# Altium schematic sheet bluetoothle.SchDoc
size A4
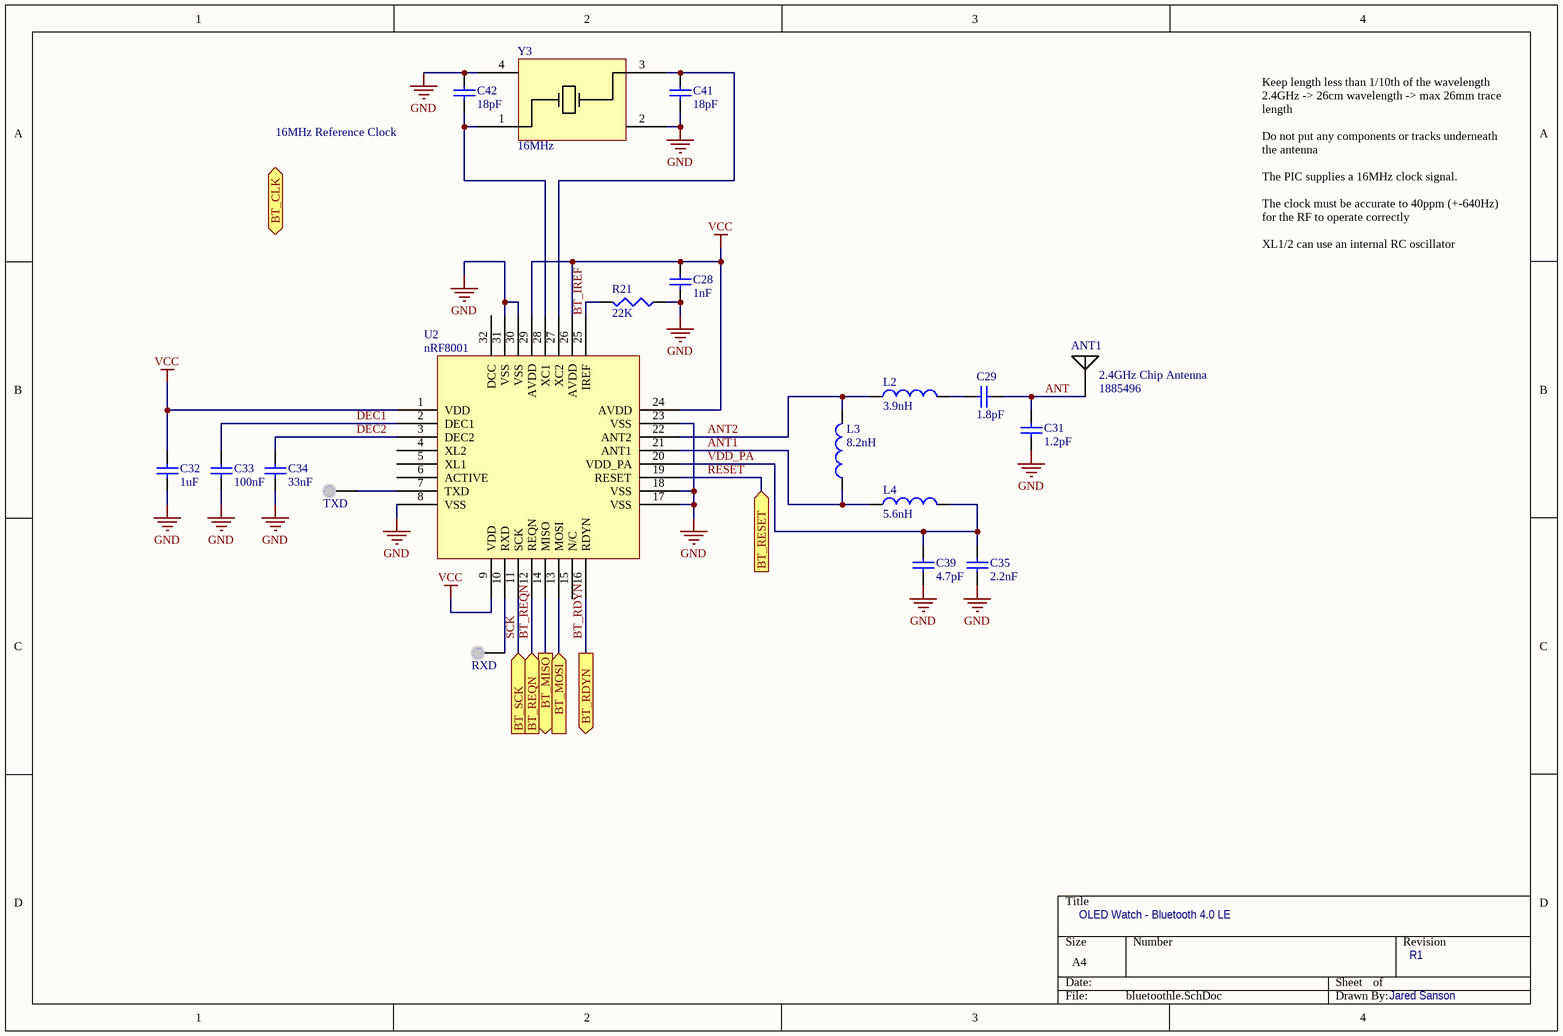
[diagram p0: bluetoothle.SchDoc]

## Parts
ANT1  2.4GHz Chip Antenna  Supplier Part Number 1: 1885496  [2450AT18A100E]
C28  value 1nF  [0603C]  (hidden comment: Cap)
C29  value 1.8pF  [0603C]  (hidden comment: Cap)
C31  value 1.2pF  [0603C]  (hidden comment: Cap)
C32  value 1uF  [0805C]  (hidden comment: Cap)
C33  value 100nF  [0603C]  (hidden comment: Cap)
C34  value 33nF  [0603C]  (hidden comment: Cap)
C35  value 2.2nF  [0603C]  (hidden comment: Cap)
C39  value 4.7pF  [0603C]  (hidden comment: Cap)
C41  value 18pF  [0603C]  (hidden comment: Cap)
C42  value 18pF  [0603C]  (hidden comment: Cap)
L2  value 3.9nH  [0603L]  (hidden comment: Inductor)
L3  value 8.2nH  [0603L]  (hidden comment: Inductor)
L4  value 5.6nH  [0603L]  (hidden comment: Inductor)
R21  value 22K  [0603R]  (hidden comment: Res3)
RXD  AN4  [TESTPOINT_TOP]  (value not drawn)
TXD  AN4  [TESTPOINT_TOP]  (value not drawn)
U2  nRF8001  [QFN50P500X500-32V5N]
Y3  value 16MHz  [TXC-16MHZ]  (hidden comment: TXC-16MHz)

## Ports
BT_CLK (in), BT_MISO (out), BT_MOSI (in), BT_RDYN (out), BT_REQN (in), BT_RESET (in), BT_SCK (in)

## Nets
GND: C28.1 C31.1 C32.2 C33.2 C34.2 C35.2 C39.2 C41.1 C42.2 R21.1 U2.8(VSS) U2.17(VSS) U2.18(VSS) U2.23(VSS) U2.30(VSS) U2.31(VSS) Y3.2 Y3.4
VCC: C28.2 C32.1 U2.1(VDD) U2.9(VDD) U2.24(AVDD) U2.26(AVDD) U2.29(AVDD)
ANT: ANT1.1 C29.2 C31.2
ANT1: L3.1 L4.1 U2.21(ANT1)
ANT2: L2.1 L3.2 U2.22(ANT2)
BT_IREF: R21.2 U2.25(IREF)
BT_MISO: U2.14(MISO) ; port BT_MISO
BT_MOSI: U2.13(MOSI) ; port BT_MOSI
BT_RDYN: U2.16(RDYN) ; port BT_RDYN
BT_REQN: U2.12(REQN) ; port BT_REQN
DEC1: C33.1 U2.2(DEC1)
DEC2: C34.1 U2.3(DEC2)
RESET: U2.19(RESET) ; port BT_RESET
SCK: U2.11(SCK) ; port BT_SCK
VDD_PA: C35.1 C39.1 L4.2 U2.20(VDD_PA)
NetC29_1: C29.1 L2.2
NetC41_2: C41.2 U2.27(XC2) Y3.3
NetC42_1: C42.1 U2.28(XC1) Y3.1
NetRXD_1: RXD.1(TP) U2.10(RXD)
NetTXD_1: TXD.1(TP) U2.7(TXD)

Not connected (* = marked no-connect by the designer): U2 4(XL2) 5(XL1) 6(ACTIVE) 15(N/C) 32(DCC)

## Notes on the sheet
- 16MHz Reference Clock
- Keep length less than 1/10th of the wavelength
  2.4GHz -> 26cm wavelength -> max 26mm trace length
  Do not put any components or tracks underneath the antenna
  The PIC supplies a 16MHz clock signal.
  The clock must be accurate to 40ppm (+-640Hz) for the RF to operate correctly
  XL1/2 can use an internal RC oscillator
- OLED Watch - Bluetooth 4.0 LE
- R1
- Jared Sanson

## Library data of the parts
ANT1 = 2450AT18A100E: Manufacturer: JOHANSON TECHNOLOGY; Description: JOHANSON TECHNOLOGY - 2450AT18A100E - ANTENNA, CERAMIC, 2.45GHZ; Supplier 1: Farnell; Manufacturer Part Number: 2450AT18A100E; RoHS: Y-EX; Pricing 1: 1=1.63, 10=1.26, 100=1.03, 500=0.693, 3000=0.511 (NZD); ComponentLink1URL: http://www.farnell.com/datasheets/1318306.pdf; ComponentLink1Description: http://www.farnell.com/datasheets/1318306.pdf; ComponentLink2URL: http://www.farnell.com/datasheets/1318299.pdf; ComponentLink2Description: http://www.farnell.com/datasheets/1318299.pdf; ComponentLink3URL: http://www.johansontechnology.com/images/stories/ip/rf-antennas/Antenna_2450AT18A100.pdf; ComponentLink3Description: http://www.johansontechnology.com/images/stories/ip/rf-antennas/Antenna_2450AT18A100.pdf
C28 C29 C31-C35 C39 C41 C42 = Cap: Capacitor; Published: 8-Jun-2000; LatestRevisionDate: 17-Jul-2002; LatestRevisionNote: Re-released for DXP Platform.; PackageReference: RAD-0.3; Publisher: Altium Limited; PackageDescription: Radial Cap, Thru-Hole; 2 Leads; 0.3 in Pin Spacing
L2-L4 = Inductor: Code_IEC: 1005; Published: 8-Jun-2000; LatestRevisionDate: 29-May-2009; LatestRevisionNote: IPC-7351 Footprint Added.; PackageReference: 0402-A; Publisher: Altium Limited; PackageDescription: Chip Inductor; Code_JEITA: 0402
R21 = Res3: Resistor; Published: 8-Jun-2000; LatestRevisionDate: 29-May-2009; LatestRevisionNote: IPC-7351 Footprint Added.; PackageReference: J1-0603; Publisher: Altium Limited; PackageDescription: Chip Resistor
RXD TXD = TestPoint: Test Point; Comment_1: *
Y3 = CrystalTXC